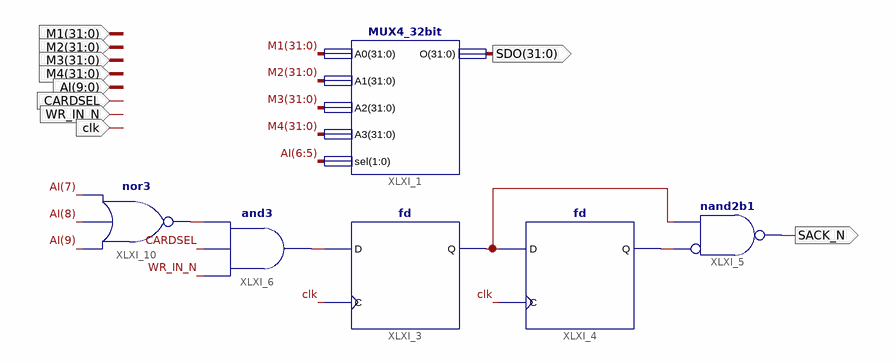
[diagram p0: schematic sheet 1]
// Xilinx ISE schematic slave_monitor.sch (spartan6) as structural Verilog: 6 symbols, 10 ports
module slave_monitor (
  input  [31:0] M1,
  input  [31:0] M2,
  input  [31:0] M3,
  input  [31:0] M4,
  input  [9:0] AI,
  input  CARDSEL,
  input  WR_IN_N,
  input  clk,
  output [31:0] SDO,
  output SACK_N
);

  wire FD_IN, XLXN_25, XLXN_26, XLXN_31;

  MUX4_32bit XLXI_1 (.A0(M1), .A1(M2), .A2(M3), .A3(M4), .sel(AI[6:5]), .O(SDO));
  fd XLXI_3 (.C(clk), .D(FD_IN), .Q(XLXN_25));
  fd XLXI_4 (.C(clk), .D(XLXN_25), .Q(XLXN_26));
  nand XLXI_5 (SACK_N, ~XLXN_26, XLXN_25);  // nand2b1
  and XLXI_6 (FD_IN, WR_IN_N, CARDSEL, XLXN_31);
  nor XLXI_10 (XLXN_31, AI[9], AI[8], AI[7]);
endmodule
